# Altium project dsau-motherboard-revA.PrjPcb (part 1 of 2)
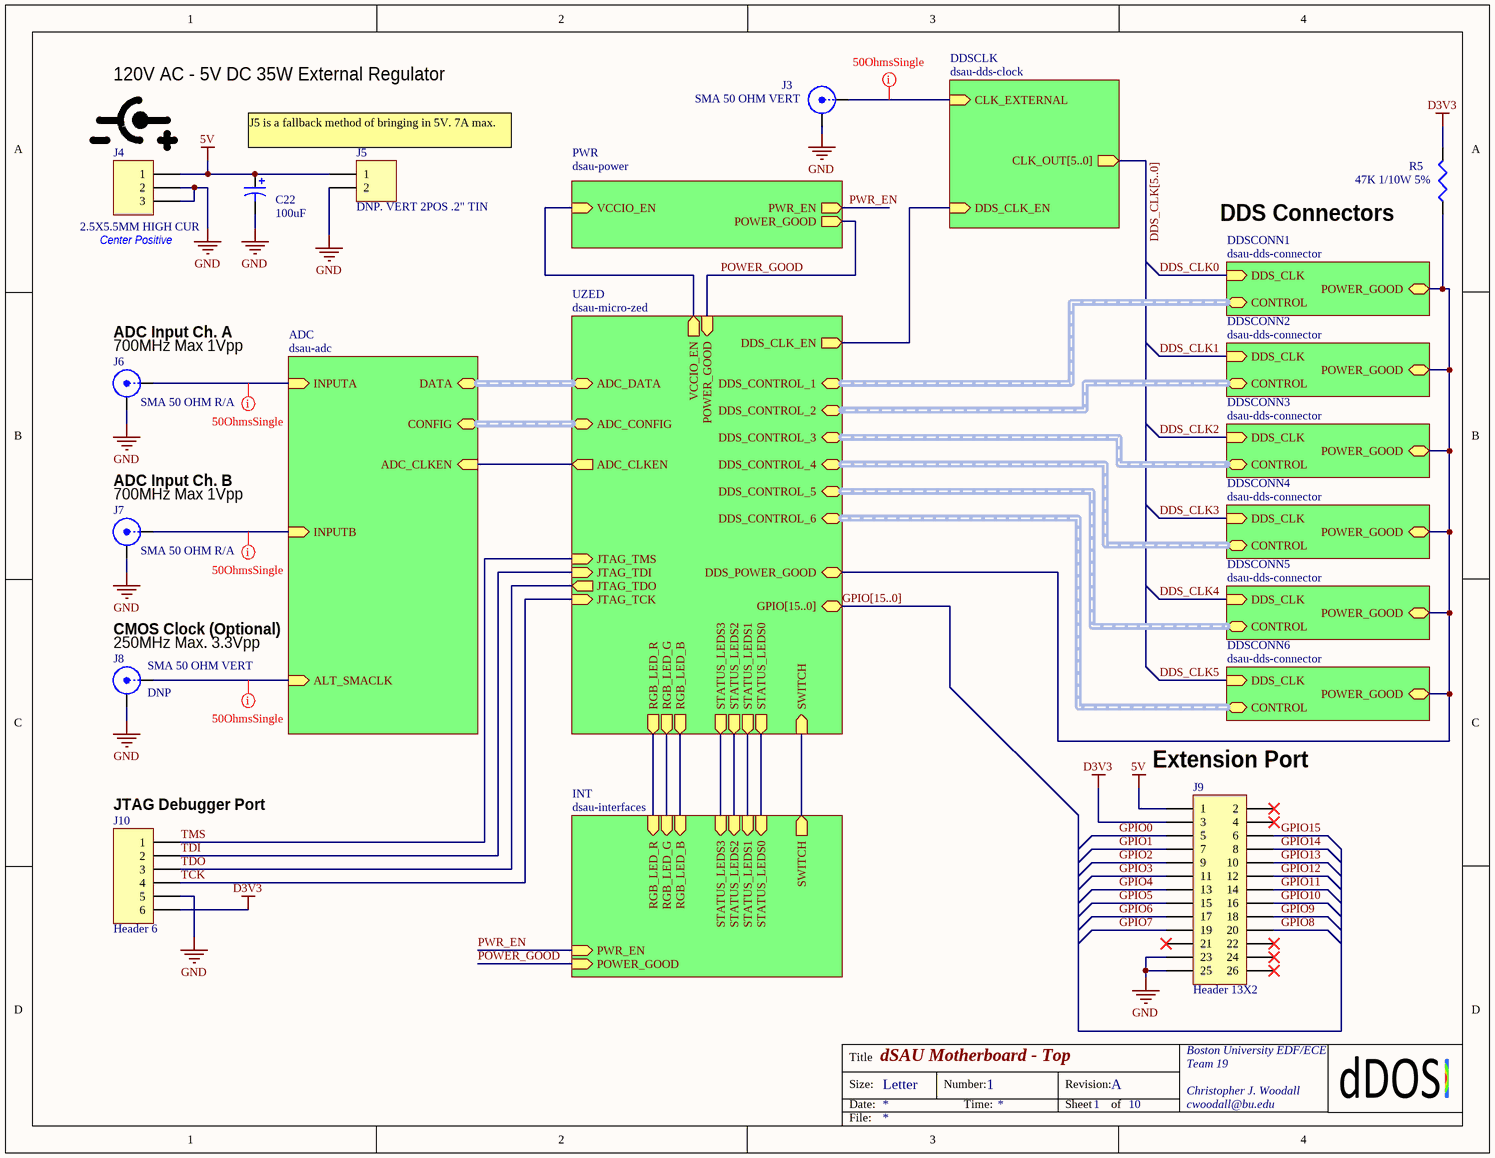
[diagram p0: dsau-motherboard-top.SchDoc]
email: <cwoodall@bu.edu>; Engineer: Christopher J. Woodall; Revision: A
10 sheets, 212 parts. Net scope: hierarchical (ports join the sheet entries above them; power ports are global).
Board file: dsau-motherboard-revA.PcbDoc
Sheets:
  dsau-motherboard-top.SchDoc
    ADC = dsau-adc.SchDoc
      AFE1 = dsau-adc-frontend.SchDoc
      AFE2 = dsau-adc-frontend.SchDoc
    PWR = dsau-power.SchDoc
    UZED = dsau-micro-zed.SchDoc
      UZEDB34 = dsau-micro-zed-bank34.SchDoc
      UZEDB35 = dsau-micro-zed-bank35.SchDoc
    DDSCONN1 = dsau-dds-connector.SchDoc
    INT = dsau-interfaces.SchDoc
    DDSCLK = dsau-dds-clock.SchDoc
    DDSCONN2 = dsau-dds-connector.SchDoc
    DDSCONN3 = dsau-dds-connector.SchDoc
    DDSCONN4 = dsau-dds-connector.SchDoc
    DDSCONN5 = dsau-dds-connector.SchDoc
    DDSCONN6 = dsau-dds-connector.SchDoc

## Sheet dsau-motherboard-top.SchDoc: dSAU Motherboard - Top
size Letter; Engineer: Christopher J. Woodall; Organization: Boston University EDF/ECE; DocumentNumber: 1; Revision: A; SheetNumber: 1; SheetTotal: 10; EMAIL: cwoodall@bu.edu; TeamName: Team 19; ProjectName: dSAU

### Parts
C22  value 100uF  [CAPPOL3216]  (hidden comment: TANT 100UF 10V 20%)
J3  SMA 50 OHM VERT  [MOLEX_SMBVERT_731000207]
J4  2.5X5.5MM HIGH CUR  [PJ-002BH]
J5  DNP. VERT 2POS .2" TIN  [MOLEX_2POS_200mil_0010085021]
J6  SMA 50 OHM R/A  [MOLEX_SMBRA_731000103]
J7  SMA 50 OHM R/A  [MOLEX_SMBRA_731000103]
J8  SMA 50 OHM VERT  value DNP  [MOLEX_SMBVERT_731000207]
J9  Header 13X2  [HDR2X13]
J10  Header 6  [HDR1X6]
R5  47K 1/10W 5%  [RESC1608L]

### Sub-sheets
ADC = dsau-adc: INPUTA (in), INPUTB (in), ALT_SMACLK (in), DATA (harness ADS62P49_LVDSDDR), ADC_CLKEN (in), CONFIG (harness ADS62P49_SPI_CONFIG)
DDSCLK = dsau-dds-clock: CLK_OUT[5..0] (out), DDS_CLK_EN (in), CLK_EXTERNAL (in)
DDSCONN1 = dsau-dds-connector: CONTROL (harness DDS_CONNECTOR), DDS_CLK (in), POWER_GOOD
DDSCONN2 = dsau-dds-connector: CONTROL (harness DDS_CONNECTOR), DDS_CLK (in), POWER_GOOD
DDSCONN3 = dsau-dds-connector: CONTROL (harness DDS_CONNECTOR), DDS_CLK (in), POWER_GOOD
DDSCONN4 = dsau-dds-connector: CONTROL (harness DDS_CONNECTOR), DDS_CLK (in), POWER_GOOD
DDSCONN5 = dsau-dds-connector: CONTROL (harness DDS_CONNECTOR), DDS_CLK (in), POWER_GOOD
DDSCONN6 = dsau-dds-connector: CONTROL (harness DDS_CONNECTOR), DDS_CLK (in), POWER_GOOD
INT = dsau-interfaces: STATUS_LEDS0 (in), STATUS_LEDS1 (in), STATUS_LEDS2 (in), STATUS_LEDS3 (in), RGB_LED_R (in), RGB_LED_G (in), RGB_LED_B (in), SWITCH (out), POWER_GOOD (in), PWR_EN (in)
PWR = dsau-power: VCCIO_EN (in), POWER_GOOD (out), PWR_EN (out)
UZED = dsau-micro-zed: ADC_DATA (harness ADS62P49_LVDSDDR), ADC_CONFIG (harness ADS62P49_SPI_CONFIG), ADC_CLKEN (out), DDS_CONTROL_1 (harness DDS_CONNECTOR), DDS_CONTROL_2 (harness DDS_CONNECTOR), DDS_CONTROL_3 (harness DDS_CONNECTOR), DDS_CONTROL_4 (harness DDS_CONNECTOR), DDS_CONTROL_5 (harness DDS_CONNECTOR), DDS_CONTROL_6 (harness DDS_CONNECTOR), JTAG_TCK (in), JTAG_TDI (in), JTAG_TDO (out), JTAG_TMS (in), STATUS_LEDS0 (out), STATUS_LEDS1 (out), STATUS_LEDS2 (out), STATUS_LEDS3 (out), RGB_LED_R (out), RGB_LED_G (out), RGB_LED_B (out), SWITCH (in), GPIO[15..0] (bidir), VCCIO_EN (out), POWER_GOOD (in), DDS_CLK_EN (out), DDS_POWER_GOOD

### Nets
5V: C22.1 J4.1 J5.1 J9.1
D3V3: J9.3 J10.6 R5.2
GND: C22.2 J3.2(Y) J4.2 J4.3 J5.2 J6.2(Y) J7.2(Y) J8.2(Y) J9.23 J9.25 J10.5
GPIO0: J9.5
GPIO1: J9.7
GPIO2: J9.9
GPIO3: J9.11
GPIO4: J9.13
GPIO5: J9.15
GPIO6: J9.17
GPIO7: J9.19
GPIO8: J9.20
GPIO9: J9.18
GPIO10: J9.16
GPIO11: J9.14
GPIO12: J9.12
GPIO13: J9.10
GPIO14: J9.8
GPIO15: J9.6
POWER_GOOD: sheet PWR/POWER_GOOD, sheet UZED/POWER_GOOD, sheet INT/POWER_GOOD
PWR_EN: sheet PWR/PWR_EN, sheet INT/PWR_EN
TCK: J10.4 ; sheet UZED/JTAG_TCK
TDI: J10.2 ; sheet UZED/JTAG_TDI
TDO: J10.3 ; sheet UZED/JTAG_TDO
TMS: J10.1 ; sheet UZED/JTAG_TMS
NetC1_1_1: J6.1(X) ; sheet ADC/INPUTA
NetC1_2_1: J7.1(X) ; sheet ADC/INPUTB
NetJ1_1_8: R5.1 ; sheet UZED/DDS_POWER_GOOD, sheet DDSCONN1/POWER_GOOD, sheet DDSCONN2/POWER_GOOD, sheet DDSCONN3/POWER_GOOD, sheet DDSCONN4/POWER_GOOD, sheet DDSCONN5/POWER_GOOD, sheet DDSCONN6/POWER_GOOD
NetJ3_1: J3.1(X) ; sheet DDSCLK/CLK_EXTERNAL
NetJ8_1: J8.1(X) ; sheet ADC/ALT_SMACLK
NetJP1_3: sheet ADC/ADC_CLKEN, sheet UZED/ADC_CLKEN
NetJP5_3: sheet UZED/DDS_CLK_EN, sheet DDSCLK/DDS_CLK_EN
NetQ3_1: sheet UZED/RGB_LED_R, sheet INT/RGB_LED_R
NetQ4_1: sheet UZED/RGB_LED_G, sheet INT/RGB_LED_G
NetQ5_1: sheet UZED/RGB_LED_B, sheet INT/RGB_LED_B
NetQ6_1: sheet UZED/STATUS_LEDS0, sheet INT/STATUS_LEDS0
NetQ7_1: sheet UZED/STATUS_LEDS1, sheet INT/STATUS_LEDS1
NetQ8_1: sheet UZED/STATUS_LEDS2, sheet INT/STATUS_LEDS2
NetQ9_1: sheet UZED/STATUS_LEDS3, sheet INT/STATUS_LEDS3
NetR18_2: sheet UZED/SWITCH, sheet INT/SWITCH
NetU8_3: sheet PWR/VCCIO_EN, sheet UZED/VCCIO_EN

Not connected (* = marked no-connect by the designer): J9 2* 4* 21* 22* 24* 26*

### Buses and harness runs
bus DDS_CLK[5..0] = sheet DDSCLK/CLK_OUT[5..0]
bus GPIO[15..0] = sheet UZED/GPIO[15..0]
harness sheet ADC/CONFIG = sheet UZED/ADC_CONFIG
harness sheet ADC/DATA = sheet UZED/ADC_DATA
harness sheet DDSCONN1/CONTROL = sheet UZED/DDS_CONTROL_1
harness sheet DDSCONN2/CONTROL = sheet UZED/DDS_CONTROL_2
harness sheet DDSCONN3/CONTROL = sheet UZED/DDS_CONTROL_3
harness sheet DDSCONN4/CONTROL = sheet UZED/DDS_CONTROL_4
harness sheet DDSCONN5/CONTROL = sheet UZED/DDS_CONTROL_5
harness sheet DDSCONN6/CONTROL = sheet UZED/DDS_CONTROL_6

### Layout directives
net class 50OhmsSingle: NetC1_1_1, NetC1_2_1, NetJ3_1, NetJ8_1

### Notes on the sheet
- 120V AC - 5V DC 35W External Regulator
- J5 is a fallback method of bringing in 5V. 7A max.
- (near R5) DDS Connectors
- (near J4) Center Positive
- (near J6) ADC Input Ch. A
- (near J6) 700MHz Max 1Vpp
- (near J7) ADC Input Ch. B
- (near J7) 700MHz Max 1Vpp
- (near J8) CMOS Clock (Optional)
- (near J8) 250MHz Max. 3.3Vpp
- (near J9) Extension Port
- (near J10) JTAG Debugger Port
- Title
- Size:
- Date:
- Letter
- Number:
- Time:
- Revision:
- Sheet
- of
- File:

### Library data of the parts
C22 = Cap Pol3: Polarized Capacitor (Surface Mount); Manufacturer: Vishay Sprague; Manufacturer Part Number: TL8A0107M010C; Published: 8-Jun-2000; LatestRevisionDate: 29-May-2009; LatestRevisionNote: IPC-7351 Footprint Added.; PackageReference: C1206; Publisher: Altium Limited; PackageDescription: Chip Capacitor; Supplier 1: Digi-Key; Supplier Part Number 1: 718-1921-1-ND
J3 J8 = SMB: SMB Straight Connector; Manufacturer: Molex Inc; Manufacturer Part Number: 0733910060; LatestRevisionDate: 17-Jul-2002; LatestRevisionNote: Re-released for DXP Platform.; Publisher: Altium Limited; Supplier 1: Digi-Key; Supplier Part Number 1: WM5543-ND
J4 = Header 3: Header, 3-Pin; Manufacturer: CUI Inc; LatestRevisionDate: 17-Jul-2002; LatestRevisionNote: Re-released for DXP Platform.; Publisher: Altium Limited; Manufacturer Part Number: PJ-002BH; Supplier 1: Digi-Key; Supplier Part Number 1: CP-002BH-ND
J5 = Header 2: Header, 2-Pin; Manufacturer: Molex Inc; Manufacturer Part Number: 0010085021; LatestRevisionDate: 17-Jul-2002; LatestRevisionNote: Re-released for DXP Platform.; Publisher: Altium Limited; Supplier 1: Digi-Key; Supplier Part Number 1: WM4333-ND
J6 J7 = SMB: SMB Straight Connector; Manufacturer: Molex Inc; Manufacturer Part Number: 0733910320; LatestRevisionDate: 17-Jul-2002; LatestRevisionNote: Re-released for DXP Platform.; Publisher: Altium Limited; Supplier 1: Digi-Key; Supplier Part Number 1: WM8554-ND
J9 = Header 13X2: Header, 13-Pin, Dual row; LatestRevisionDate: 17-Jul-2002; LatestRevisionNote: Re-released for DXP Platform.; Publisher: Altium Limited; Supplier 1: Stock; Supplier Part Number 1: 2x13 pin 100mil Headers
J10 = Header 6: Header, 6-Pin; LatestRevisionDate: 17-Jul-2002; LatestRevisionNote: Re-released for DXP Platform.; Publisher: Altium Limited; Supplier 1: Stock; Supplier Part Number 1: 6 pin 100 mil
R5 = Res3: Resistor; Manufacturer: Yageo; Manufacturer Part Number: 311-47kGRCT-ND; Published: 8-Jun-2000; LatestRevisionDate: 29-May-2009; LatestRevisionNote: IPC-7351 Footprint Added.; PackageReference: J1-0603; Publisher: Altium Limited; PackageDescription: Chip Resistor; Supplier 1: Digi-Key; Supplier Part Number 1: 311-47KGRTR-ND; Value: 47K

## Sheet dsau-adc.SchDoc: dSAU Motherboard - ADC
size Letter; Engineer: Christopher J. Woodall; Organization: Boston University EDF/ECE; DocumentNumber: 3; Revision: A; SheetNumber: 3; SheetTotal: 10; EMAIL: cwoodall@bu.edu; TeamName: Team 19; ProjectName: dSAU
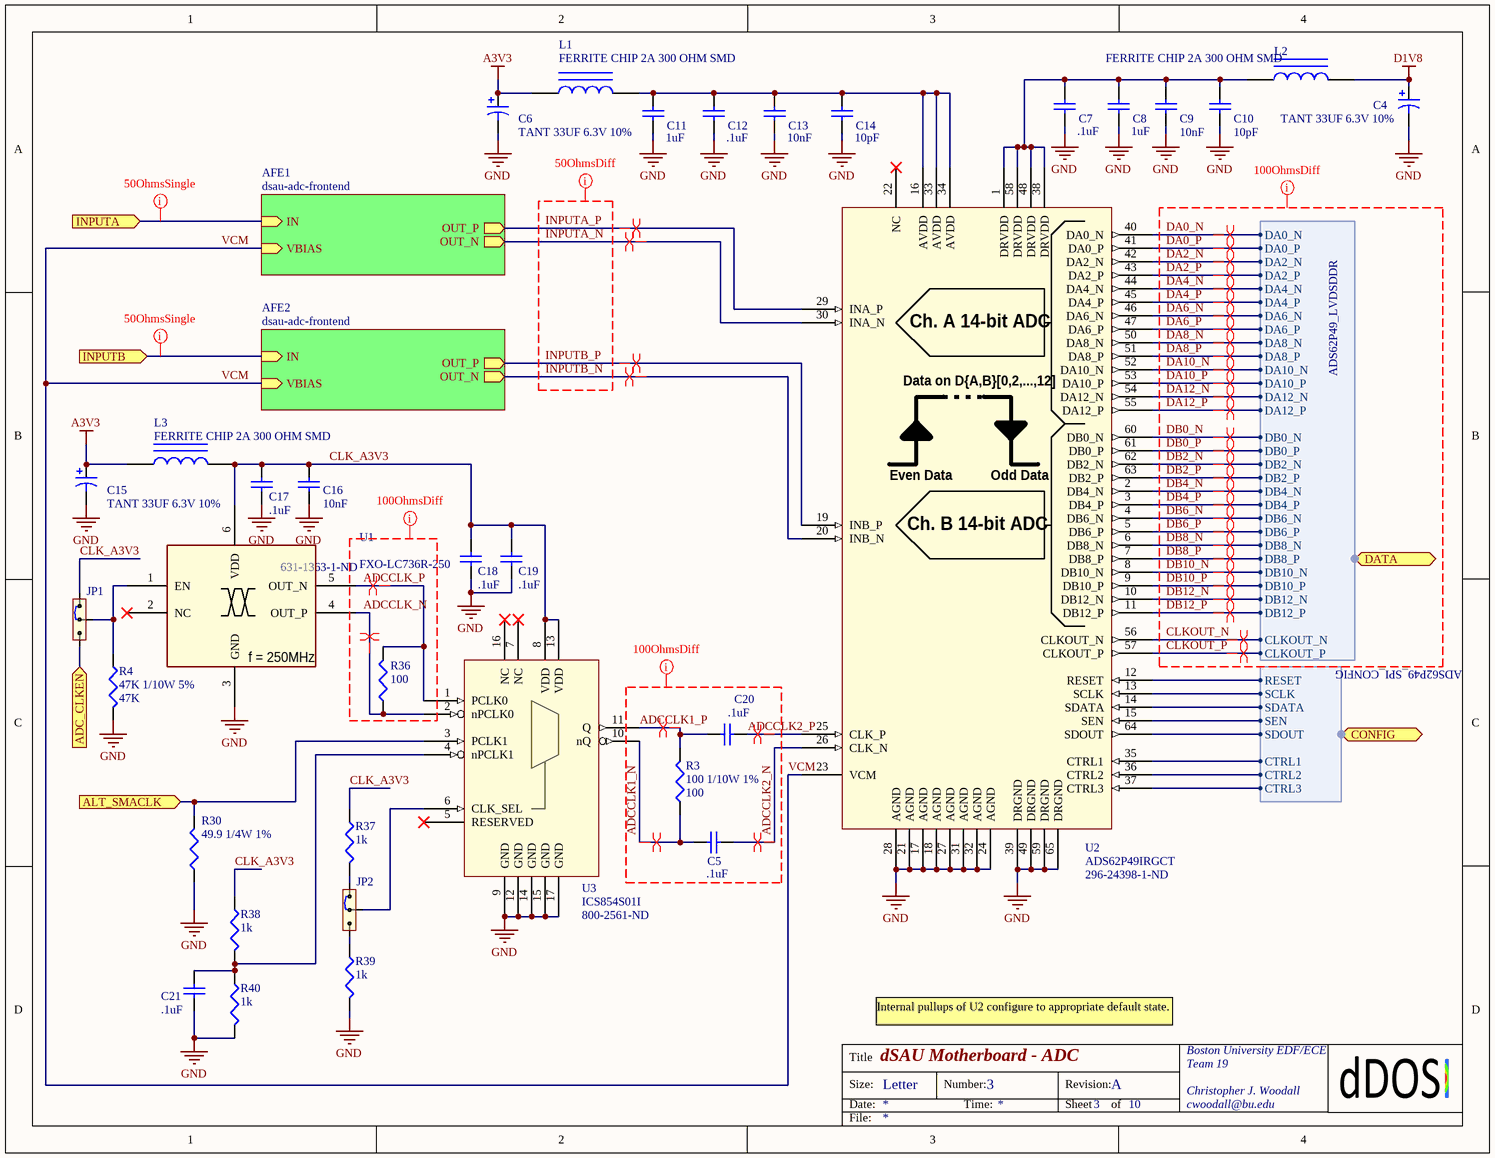
[diagram p1: dsau-adc.SchDoc]

### Parts
C4  TANT 33UF 6.3V 10%  [CAPC2012L]
C5  value .1uF  [CAPC1608L]  (hidden comment: CER 0.1UF 50V Y5V)
C6  TANT 33UF 6.3V 10%  [CAPC2012L]
C7  value .1uF  [CAPC1608L]  (hidden comment: CER 0.1UF 50V Y5V)
C8  value 1uF  [CAPC2012L]  (hidden comment: CER 1UF 16V 10% X7R)
C9  value 10nF  [CAPC1608L]  (hidden comment: CER 10NF 25V 10% NP0)
C10  value 10pF  [CAPC1608L]  (hidden comment: CER 10PF 50V 5% NP0)
C11  value 1uF  [CAPC2012L]  (hidden comment: CER 1UF 16V 10% X7R)
C12  value .1uF  [CAPC1608L]  (hidden comment: CER 0.1UF 50V Y5V)
C13  value 10nF  [CAPC1608L]  (hidden comment: CER 10NF 25V 10% NP0)
C14  value 10pF  [CAPC1608L]  (hidden comment: CER 10PF 50V 5% NP0)
C15  TANT 33UF 6.3V 10%  [CAPC2012L]
C16  value 10nF  [CAPC1608L]  (hidden comment: CER 10NF 25V 10% NP0)
C17  value .1uF  [CAPC1608L]  (hidden comment: CER 0.1UF 50V Y5V)
C18  value .1uF  [CAPC1608L]  (hidden comment: CER 0.1UF 50V Y5V)
C19  value .1uF  [CAPC1608L]  (hidden comment: CER 0.1UF 50V Y5V)
C20  value .1uF  [CAPC1608L]  (hidden comment: CER 0.1UF 50V Y5V)
C21  value .1uF  [CAPC1608L]  (hidden comment: CER 0.1UF 50V Y5V)
JP1  JUMPER_2WAY  [HDR1X3]  (value not drawn)
JP2  JUMPER_2WAY  [HDR1X3]  (value not drawn)
L1  FERRITE CHIP 2A 300 OHM SMD  [INDC1608L]
L2  FERRITE CHIP 2A 300 OHM SMD  [INDC1608L]
L3  FERRITE CHIP 2A 300 OHM SMD  [INDC1608L]
R3  100 1/10W 1%  value 100  [RESC1608L]
R4  47K 1/10W 5%  value 47K  [RESC1608L]
R30  49.9 1/4W 1%  [RESC3216L]
R36  value 100  [RESC1608L]  (hidden comment: 100 1/10W 1%)
R37  value 1k  [RESC1608L]  (hidden comment: 100 1/10W 1%)
R38  value 1k  [RESC1608L]  (hidden comment: 100 1/10W 1%)
R39  value 1k  [RESC1608L]  (hidden comment: 100 1/10W 1%)
R40  value 1k  [RESC1608L]  (hidden comment: 100 1/10W 1%)
U1  Supplier Part Number 1: 631-1363-1-ND  Manufacturer Part Number: FXO-LC736R-250  [FXO-LC736R-SMD_6]  (hidden comment: FXO-LC736R-250MHz)
U2  Manufacturer Part Number: ADS62P49IRGCT  Supplier Part Number 1: 296-24398-1-ND  [VQFN-64]  (hidden comment: ADS62P49_SINGLE)
U3  ICS854S01I  Supplier Part Number 1: 800-2561-ND  [VFQFN16_CUSTOM]

### Sub-sheets
AFE1 = dsau-adc-frontend: IN (in), OUT_P (out), OUT_N (out), VBIAS (in)
AFE2 = dsau-adc-frontend: IN (in), OUT_P (out), OUT_N (out), VBIAS (in)

### Ports
ADC_CLKEN (in), ALT_SMACLK (in), CONFIG (harness ADS62P49_SPI_CONFIG), DATA (harness ADS62P49_LVDSDDR), INPUTA (in), INPUTB (in)

### Harnesses
ADS62P49_LVDSDDR: DA0_N, DA2_N, DA4_N, DA6_N, DA8_N, DA10_N, DA12_N, DA0_P, DA2_P, DA4_P, DA6_P, DA8_P, DA10_P, DA12_P, DB0_N, DB2_N, DB4_N, DB6_N, DB8_N, DB10_N, DB12_N, DB0_P, DB2_P, DB4_P, DB6_P, DB8_P, DB10_P, DB12_P, CLKOUT_P, CLKOUT_N
ADS62P49_SPI_CONFIG: RESET, SCLK, SDATA, SEN, SDOUT, CTRL1, CTRL2, CTRL3

### Nets
A3V3: C6.1 C15.1 L1.2 L3.2
D1V8: C4.1 L2.1
GND: C4.2 C6.2 C7.2 C8.2 C9.2 C10.2 C11.2 C12.2 C13.2 C14.2 C15.2 C16.2 C17.2 C18.2 C19.2 C21.2 R4.2 R30.1 R39.2 R40.2 U1.3(GND) U2.17(AGND) U2.18(AGND) U2.21(AGND) U2.24(AGND) U2.27(AGND) U2.28(AGND) U2.31(AGND) U2.32(AGND) U2.39(DRGND) U2.49(DRGND) U2.59(DRGND) U2.65(DRGND) U3.9(GND) U3.12(GND) U3.14(GND) U3.15(GND) U3.17(GND)
ADCCLK1_N: C5.1 R3.1 U3.10(nQ)
ADCCLK1_P: C20.1 R3.2 U3.11(Q)
ADCCLK2_N: C5.2 U2.26(CLK_N)
ADCCLK2_P: C20.2 U2.25(CLK_P)
ADCCLK_N: R36.1 U1.4(OUT_P) U3.2(nPCLK0)
ADCCLK_P: R36.2 U1.5(OUT_N) U3.1(PCLK0)
CLK_A3V3: C16.1 C17.1 C18.1 C19.1 JP1.1 L3.1 R37.1 R38.1 U1.6(VDD) U3.8(VDD) U3.13(VDD)
CLKOUT_N: U2.56(CLKOUT_N) ; port DATA.CLKOUT_N
CLKOUT_P: U2.57(CLKOUT_P) ; port DATA.CLKOUT_P
DA0_N: U2.40(DA0_N) ; port DATA.DA0_N
DA0_P: U2.41(DA0_P) ; port DATA.DA0_P
DA2_N: U2.42(DA2_N) ; port DATA.DA2_N
DA2_P: U2.43(DA2_P) ; port DATA.DA2_P
DA4_N: U2.44(DA4_N) ; port DATA.DA4_N
DA4_P: U2.45(DA4_P) ; port DATA.DA4_P
DA6_N: U2.46(DA6_N) ; port DATA.DA6_N
DA6_P: U2.47(DA6_P) ; port DATA.DA6_P
DA8_N: U2.50(DA8_N) ; port DATA.DA8_N
DA8_P: U2.51(DA8_P) ; port DATA.DA8_P
DA10_N: U2.52(DA10_N) ; port DATA.DA10_N
DA10_P: U2.53(DA10_P) ; port DATA.DA10_P
DA12_N: U2.54(DA12_N) ; port DATA.DA12_N
DA12_P: U2.55(DA12_P) ; port DATA.DA12_P
DB0_N: U2.60(DB0_N) ; port DATA.DB0_N
DB0_P: U2.61(DB0_P) ; port DATA.DB0_P
DB2_N: U2.62(DB2_N) ; port DATA.DB2_N
DB2_P: U2.63(DB2_P) ; port DATA.DB2_P
DB4_N: U2.2(DB4_N) ; port DATA.DB4_N
DB4_P: U2.3(DB4_P) ; port DATA.DB4_P
DB6_N: U2.4(DB6_N) ; port DATA.DB6_N
DB6_P: U2.5(DB6_P) ; port DATA.DB6_P
DB8_N: U2.6(DB8_N) ; port DATA.DB8_N
DB8_P: U2.7(DB8_P) ; port DATA.DB8_P
DB10_N: U2.8(DB10_N) ; port DATA.DB10_N
DB10_P: U2.9(DB10_P) ; port DATA.DB10_P
DB12_N: U2.10(DB12_N) ; port DATA.DB12_N
DB12_P: U2.11(DB12_P) ; port DATA.DB12_P
INPUTA_N: U2.30(INA_N) ; sheet AFE1/OUT_N
INPUTA_P: U2.29(INA_P) ; sheet AFE1/OUT_P
INPUTB_N: U2.20(INB_N) ; sheet AFE2/OUT_N
INPUTB_P: U2.19(INB_P) ; sheet AFE2/OUT_P
VCM: U2.23(VCM) ; sheet AFE1/VBIAS, sheet AFE2/VBIAS
NetC1_1_1: port INPUTA, sheet AFE1/IN
NetC1_2_1: port INPUTB, sheet AFE2/IN
NetC7_1: C7.1 C8.1 C9.1 C10.1 L2.2 U2.1(DRVDD) U2.38(DRVDD) U2.48(DRVDD) U2.58(DRVDD)
NetC11_1: C11.1 C12.1 C13.1 C14.1 L1.1 U2.16(AVDD) U2.33(AVDD) U2.34(AVDD)
NetC21_1: C21.1 R38.2 R40.1 U3.4(nPCLK1)
NetJ8_1: R30.2 U3.3(PCLK1) ; port ALT_SMACLK
NetJP1_2: JP1.2 R4.1 U1.1(EN)
NetJP1_3: JP1.3 ; port ADC_CLKEN
NetJP2_1: JP2.1 R37.2
NetJP2_2: JP2.2 U3.6(CLK_SEL)
NetJP2_3: JP2.3 R39.1
NetU2_12: U2.12(RESET) ; port CONFIG.RESET
NetU2_13: U2.13(SCLK) ; port CONFIG.SCLK
NetU2_14: U2.14(SDATA) ; port CONFIG.SDATA
NetU2_15: U2.15(SEN) ; port CONFIG.SEN
NetU2_35: U2.35(CTRL1) ; port CONFIG.CTRL1
NetU2_36: U2.36(CTRL2) ; port CONFIG.CTRL2
NetU2_37: U2.37(CTRL3) ; port CONFIG.CTRL3
NetU2_64: U2.64(SDOUT) ; port CONFIG.SDOUT

Not connected (* = marked no-connect by the designer): U1 2(NC)*; U2 22(NC)*; U3 5(RESERVED)* 7(NC)* 16(NC)*

### Layout directives
differential pair: ADCCLK1_N, ADCCLK1_P, ADCCLK2_N, ADCCLK2_P, ADCCLK_N, ADCCLK_P, CLKOUT_N, CLKOUT_P, DA0_N, DA0_P, DA2_N, DA2_P, DA4_N, DA4_P, DA6_N, DA6_P, DA8_N, DA8_P, DA10_N, DA10_P, DA12_N, DA12_P, DB0_N, DB0_P, DB2_N, DB2_P, DB4_N, DB4_P, DB6_N, DB6_P, DB8_N, DB8_P, DB10_N, DB10_P, DB12_N, DB12_P, INPUTA_N, INPUTA_P, INPUTB_N, INPUTB_P
net class 100OhmsDiff: ADCCLK1_N, ADCCLK1_P, ADCCLK2_N, ADCCLK2_P, ADCCLK_N, ADCCLK_P, CLKOUT_N, CLKOUT_P, DA0_N, DA0_P, DA2_N, DA2_P, DA4_N, DA4_P, DA6_N, DA6_P, DA8_N, DA8_P, DA10_N, DA10_P, DA12_N, DA12_P, DB0_N, DB0_P, DB2_N, DB2_P, DB4_N, DB4_P, DB6_N, DB6_P, DB8_N, DB8_P, DB10_N, DB10_P, DB12_N, DB12_P
net class 50OhmsDiff: INPUTA_N, INPUTA_P, INPUTB_N, INPUTB_P
net class 50OhmsSingle: NetC1_1_1, NetC1_2_1

### Notes on the sheet
- Internal pullups of U2 configure to appropriate default state.
  In case where RESET is pulled low all possible valid states (for our application) are available by pulling SCLK, SDATA, SEN low.
- Title
- Size:
- Date:
- Letter
- Number:
- Time:
- Revision:
- Sheet
- of
- File:
- (in symbol ADS62P49_SINGLE) Ch. A 14-bit ADC; Data on D{A,B}[0,2,...,12]; Even Data; Odd Data; Ch. B 14-bit ADC
- (in symbol FXO-LC736R-250MHz) f = 250MHz

### Library data of the parts
C4 C6 C15 = Cap Pol3: Polarized Capacitor (Surface Mount); Manufacturer: AVX Corporation; Manufacturer Part Number: TPSA336K006R0600; Published: 8-Jun-2000; LatestRevisionDate: 29-May-2009; LatestRevisionNote: IPC-7351 Footprint Added.; PackageReference: C1206; Publisher: Altium Limited; PackageDescription: Chip Capacitor; Value: 33uF; Supplier 1: Digi-Key; Supplier Part Number 1: 478-1755-1-ND
C5 C7 C12 C17-C21 = Cap: Capacitor; Manufacturer: Yageo; Manufacturer Part Number: CC0603ZRY5V9BB104; Published: 8-Jun-2000; LatestRevisionDate: 17-Jul-2002; LatestRevisionNote: Re-released for DXP Platform.; PackageReference: RAD-0.3; Publisher: Altium Limited; Supplier 1: Digi-Key; Supplier Part Number 1: 311-1343-1-ND
C8 C11 = Cap: Capacitor; Manufacturer: Yageo; Manufacturer Part Number: CC0805KKX7R7BB105; Published: 8-Jun-2000; LatestRevisionDate: 17-Jul-2002; LatestRevisionNote: Re-released for DXP Platform.; PackageReference: RAD-0.3; Publisher: Altium Limited; Supplier 1: Digi-Key; Supplier Part Number 1: 311-1365-1-ND
C9 C13 C16 = Cap: Capacitor; Manufacturer: Kemet; Manufacturer Part Number: C0603C103K3GACTU; Published: 8-Jun-2000; LatestRevisionDate: 17-Jul-2002; LatestRevisionNote: Re-released for DXP Platform.; PackageReference: RAD-0.3; Publisher: Altium Limited; Supplier 1: Digi-Key; Supplier Part Number 1: 399-8987-1-ND
C10 C14 = Cap: Capacitor; Manufacturer: Samsung Electro-Mechanics America, Inc; Manufacturer Part Number: CL10C100JB8NCNC; Published: 8-Jun-2000; LatestRevisionDate: 17-Jul-2002; LatestRevisionNote: Re-released for DXP Platform.; PackageReference: RAD-0.3; Publisher: Altium Limited; Supplier 1: Digi-Key; Supplier Part Number 1: 1276-2154-1-ND
L1-L3 = Inductor Iron: Magnetic-Core Inductor; Manufacturer: Laird-Signal Integrity Products; Manufacturer Part Number: MI0603L301R-10; Value: 2A 300 OHM @ 100MHz; Published: 24-Mar-1999; LatestRevisionDate: 17-Jul-2002; LatestRevisionNote: Re-released for DXP Platform.; PackageReference: AXIAL-0.9; Publisher: Altium Limited; Supplier 1: Digi-Key; Supplier Part Number 1: 240-2374-1-ND
R3 R36 = Res3: Resistor; Manufacturer: Yageo; Manufacturer Part Number: RC0603FR-07100RL; Published: 8-Jun-2000; LatestRevisionDate: 29-May-2009; LatestRevisionNote: IPC-7351 Footprint Added.; PackageReference: J1-0603; Publisher: Altium Limited; PackageDescription: Chip Resistor; Supplier 1: Digi-Key; Supplier Part Number 1: 311-100HRCT-ND
R4 = Res3: as R5 on sheet dsau-motherboard-top; Published: 8-Jun-2000; LatestRevisionDate: 29-May-2009; LatestRevisionNote: IPC-7351 Footprint Added.; PackageReference: J1-0603; Publisher: Altium Limited; PackageDescription: Chip Resistor; Supplier 1: Digi-Key; Supplier Part Number 1: 311-47KGRTR-ND
R30 = Res3: Resistor; Manufacturer: Panasonic Electronic Components; Manufacturer Part Number: ERJ-8ENF49R9V; Value: 49.9; Published: 8-Jun-2000; LatestRevisionDate: 29-May-2009; LatestRevisionNote: IPC-7351 Footprint Added.; PackageReference: J1-0603; Publisher: Altium Limited; PackageDescription: Chip Resistor; Supplier 1: Digi-Key; Supplier Part Number 1: P49.9FCT-ND
R37-R40 = Res3: Resistor; Manufacturer: Yageo; Manufacturer Part Number: RC0603JR-071KL; Published: 8-Jun-2000; LatestRevisionDate: 29-May-2009; LatestRevisionNote: IPC-7351 Footprint Added.; PackageReference: J1-0603; Publisher: Altium Limited; PackageDescription: Chip Resistor; Supplier 1: Digi-Key; Supplier Part Number 1: 311-1.0KGRCT-ND
U1 = FXO-LC736R-250MHz: OSC 250 MHZ 3.3V LVDS SMD; Manufacturer: Fox Electronics; Supplier 1: Digi-Key
U2 = ADS62P49_SINGLE: IC ADC DUAL 14BIT 250MSPS 64VQFN; Manufacturer: Texas Instruments; Supplier 1: Digi-key
U3 = ICS854S01I: Supplier 1: Digi-Key

## Sheet dsau-adc-frontend.SchDoc: dSAU Motherboard - ADC Frontend
size Letter; Engineer: Christopher J. Woodall; Organization: Boston University EDF/ECE; DocumentNumber: 4; Revision: A; SheetNumber: 4; SheetTotal: 10; EMAIL: cwoodall@bu.edu; TeamName: Team 19; ProjectName: dSAU
Used 2 times, as channels ADC/AFE1, ADC/AFE2. Parts and nets are listed once, with the designators drawn on the sheet.
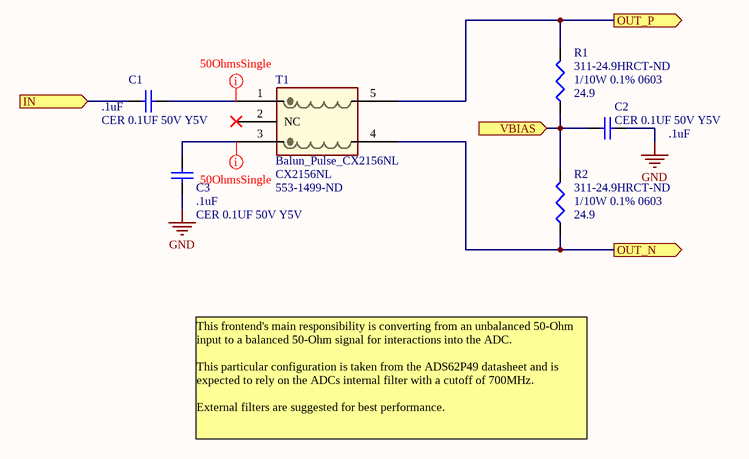
[diagram p2: dsau-adc-frontend.SchDoc]

### Parts
C1  CER 0.1UF 50V Y5V  value .1uF  [CAPC1608L]
C2  CER 0.1UF 50V Y5V  value .1uF  [CAPC1608L]
C3  CER 0.1UF 50V Y5V  value .1uF  [CAPC1608L]
R1  1/10W 0.1% 0603  value 24.9  Supplier Part Number 1: 311-24.9HRCT-ND  [RESC1608L]
R2  1/10W 0.1% 0603  value 24.9  Supplier Part Number 1: 311-24.9HRCT-ND  [RESC1608L]
T1  Balun_Pulse_CX2156NL  Manufacturer Part Number: CX2156NL  Supplier Part Number 1: 553-1499-ND  [CX2156NL_SMD5]

### Ports
IN (in), OUT_N (out), OUT_P (out), VBIAS (in)

### Nets
GND: C2.2 C3.1
IN: C1.1 ; port IN
OUT_N: R2.1 T1.4 ; port OUT_N
OUT_P: R1.2 T1.5 ; port OUT_P
VBIAS: C2.1 R1.1 R2.2 ; port VBIAS
NetC1_2: C1.2 T1.1
NetC3_2: C3.2 T1.3

Not connected (* = marked no-connect by the designer): T1 2(NC)*

### Channels
ADC/AFE1: designators end in _1; ports IN=NetC1_1_1 OUT_N=INPUTA_N OUT_P=INPUTA_P VBIAS=VCM
ADC/AFE2: designators end in _2; ports IN=NetC1_2_1 OUT_N=INPUTB_N OUT_P=INPUTB_P VBIAS=VCM

### Layout directives
net class 50OhmsSingle: NetC1_1_2, NetC3_1_2

### Notes on the sheet
- This frontend's main responsibility is converting from an unbalanced 50-Ohm input to a balanced 50-Ohm signal for interactions into the ADC.
  This particular configuration is taken from the ADS62P49 datasheet and is expected to rely on the ADCs internal filter with a cutoff of 700MHz.
  External filters are suggested for best performance.
- Title
- Size:
- Date:
- Letter
- Number:
- Time:
- Revision:
- Sheet
- of
- File:

### Library data of the parts
C1-C3 = Cap: as C5 on sheet dsau-adc; Published: 8-Jun-2000; LatestRevisionDate: 17-Jul-2002; LatestRevisionNote: Re-released for DXP Platform.; PackageReference: RAD-0.3; Publisher: Altium Limited; Supplier 1: Digi-Key; Supplier Part Number 1: 311-1343-1-ND
R1 R2 = Res3: Resistor; Manufacturer: Yageo; Manufacturer Part Number: RC0603FR-0724R9L; Published: 8-Jun-2000; LatestRevisionDate: 29-May-2009; LatestRevisionNote: IPC-7351 Footprint Added.; PackageReference: J1-0603; Publisher: Altium Limited; PackageDescription: Chip Resistor; Supplier 1: Digi-Key
T1 = Balun_Pulse_CX2156NL: TRANSFORMR BALUN 2.3-2700MHZ SMD; Manufacturer: Pulse Electronics Corporation; Supplier 1: Digi-Key

## Sheet dsau-power.SchDoc: dSAU Motherboard - Power
size Letter; Engineer: Christopher J. Woodall; Organization: Boston University EDF/ECE; DocumentNumber: 2; Revision: A; SheetNumber: 2; SheetTotal: 10; EMAIL: cwoodall@bu.edu; TeamName: Team 19; ProjectName: dSAU
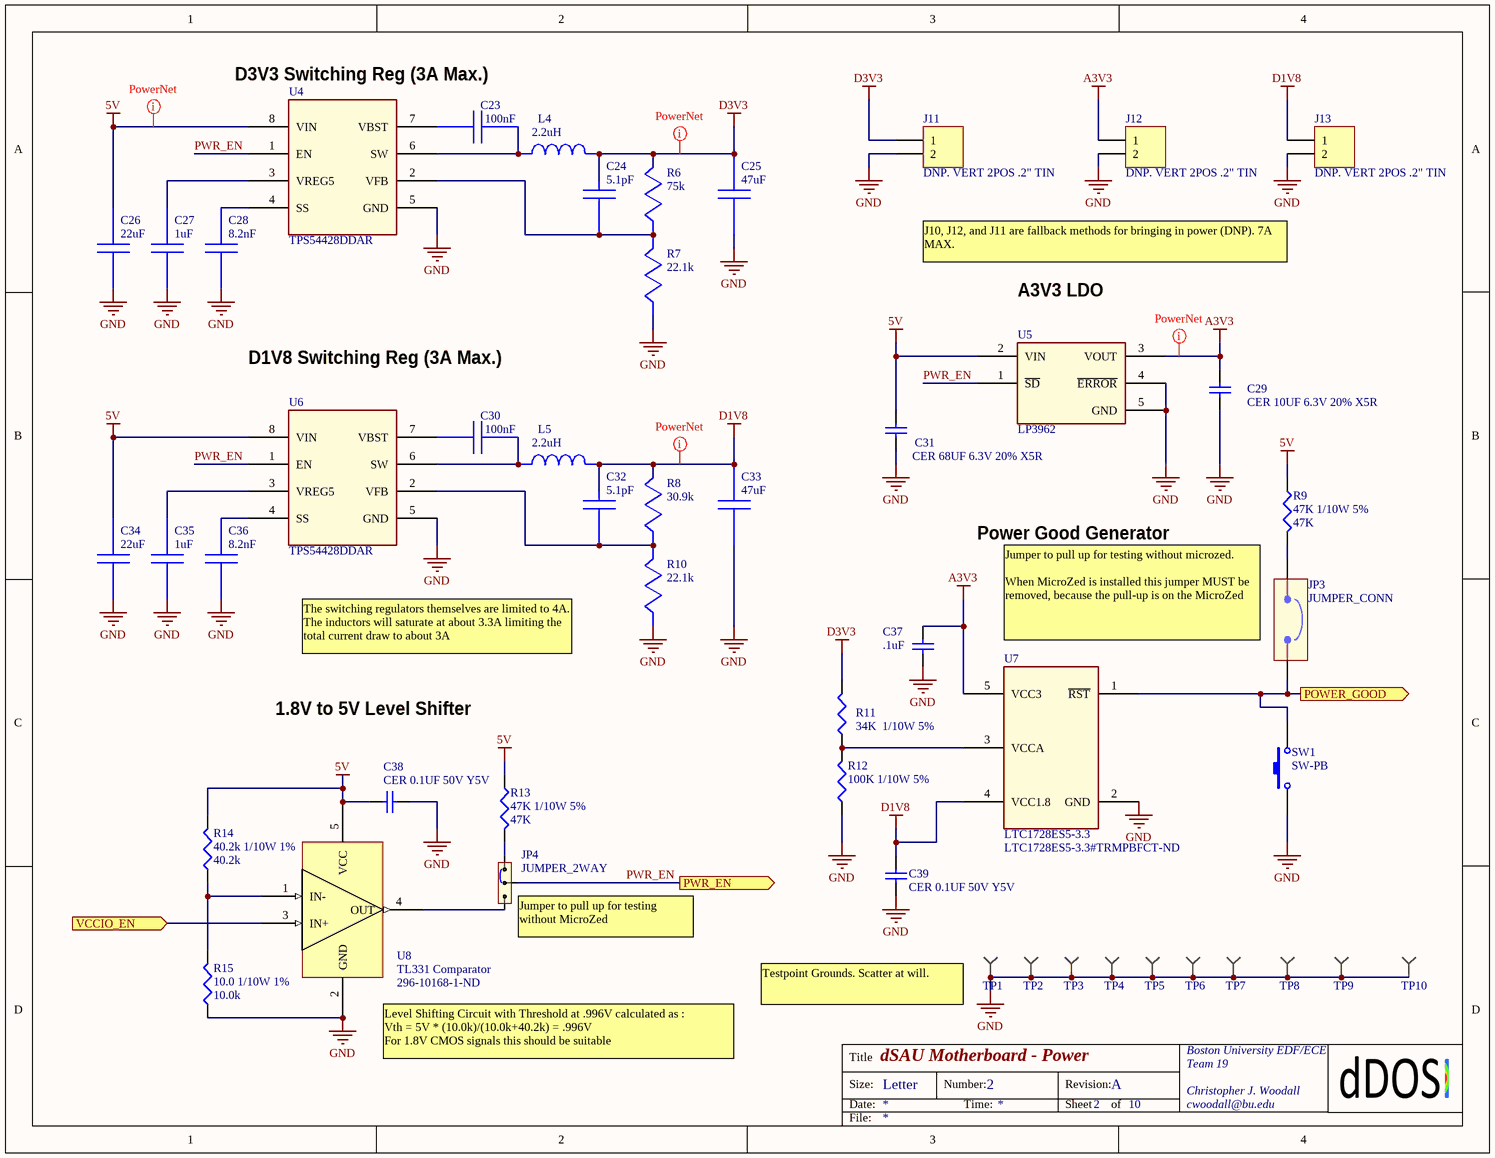
[diagram p3: dsau-power.SchDoc]

### Parts
C23  100nF  [0402]
C24  5.1pF  [0402]
C25  47uF  [1206]
C26  22uF  [1210]
C27  1uF  [0402]
C28  8.2nF  [0402]
C29  CER 10UF 6.3V 20% X5R  [CAPC1608L]
C30  100nF  [0402]
C31  CER 68UF 6.3V 20% X5R  [CAPC3216L]
C32  5.1pF  [0402]
C33  47uF  [1206]
C34  22uF  [1210]
C35  1uF  [0402]
C36  8.2nF  [0402]
C37  value .1uF  [CAPC1608L]  (hidden comment: CER 0.1UF 50V Y5V)
C38  CER 0.1UF 50V Y5V  [CAPC1608L]
C39  CER 0.1UF 50V Y5V  [CAPC1608L]
J11  DNP. VERT 2POS .2" TIN  [MOLEX_2POS_200mil_0010085021]
J12  DNP. VERT 2POS .2" TIN  [MOLEX_2POS_200mil_0010085021]
J13  DNP. VERT 2POS .2" TIN  [MOLEX_2POS_200mil_0010085021]
JP3  JUMPER_CONN  [HDR1X2]
JP4  JUMPER_2WAY  [HDR1X3]
L4  2.2uH  [SRN6045]
L5  2.2uH  [SRN6045]
R6  75k  [0402]
R7  22.1k  [0402]
R8  30.9k  [0402]
R9  47K 1/10W 5%  value 47K  [RESC1608L]
R10  22.1k  [0402]
R11  34K  1/10W 5%  [RESC1608L]
R12  100K 1/10W 5%  [RESC1608L]
R13  47K 1/10W 5%  value 47K  [RESC1608L]
R14  40.2k 1/10W 1%  value 40.2k  [RESC1608L]
R15  10.0 1/10W 1%  value 10.0k  [RESC1608L]
SW1  SW-PB  [SPST_SW_FSM4JH]
TP1  TESTPOINT_CW  [PIN1]  (value not drawn)
TP2  TESTPOINT_CW  [PIN1]  (value not drawn)
TP3  TESTPOINT_CW  [PIN1]  (value not drawn)
TP4  TESTPOINT_CW  [PIN1]  (value not drawn)
TP5  TESTPOINT_CW  [PIN1]  (value not drawn)
TP6  TESTPOINT_CW  [PIN1]  (value not drawn)
TP7  TESTPOINT_CW  [PIN1]  (value not drawn)
TP8  TESTPOINT_CW  [PIN1]  (value not drawn)
TP9  TESTPOINT_CW  [PIN1]  (value not drawn)
TP10  TESTPOINT_CW  [PIN1]  (value not drawn)
U4  TPS54428DDAR  [R-PDSO-G8]
U5  LP3962  [SOT223-5N]
U6  TPS54428DDAR  [R-PDSO-G8]
U7  LTC1728ES5-3.3  Supplier Part Number 1: LTC1728ES5-3.3#TRMPBFCT-ND  [SOT23_5L_CUSTOM]
U8  TL331 Comparator  Supplier Part Number 1: 296-10168-1-ND  [SOT23_5L_CUSTOM]

### Ports
POWER_GOOD (out), PWR_EN (out), VCCIO_EN (in)

### Nets
5V: C26.1 C31.2 C34.1 C38.1 R9.1 R13.1 R14.2 U4.8(VIN) U5.2(VIN) U6.8(VIN) U8.5(VCC)
A3V3: C29.2 C37.1 J12.1 U5.3(VOUT) U7.5(VCC3)
D1V8: C32.1 C33.1 C39.2 J13.1 L5.1 R8.1 U7.4(VCC1.8)
D3V3: C24.1 C25.1 J11.1 L4.1 R6.1 R11.2
GND: C25.2 C26.2 C27.2 C28.2 C29.1 C31.1 C33.2 C34.2 C35.2 C36.2 C37.2 C38.2 C39.1 J11.2 J12.2 J13.2 R7.2 R10.2 R12.1 R15.1 SW1.2 TP1.1 TP2.1 TP3.1 TP4.1 TP5.1 TP6.1 TP7.1 TP8.1 TP9.1 TP10.1 U4.5(GND) U5.4(~{ERROR}) U5.5(GND) U6.5(GND) U7.2(GND) U8.2(GND)
POWER_GOOD: JP3.1 SW1.1 U7.1(~{RST}) ; port POWER_GOOD
PWR_EN: JP4.2 U4.1(EN) U5.1(~{SD}) U6.1(EN) ; port PWR_EN
NetC23_1: C23.1 U4.7(VBST)
NetC23_2: C23.2 L4.2 U4.6(SW)
NetC24_2: C24.2 R6.2 R7.1 U4.2(VFB)
NetC27_1: C27.1 U4.3(VREG5)
NetC28_1: C28.1 U4.4(SS)
NetC30_1: C30.1 U6.7(VBST)
NetC30_2: C30.2 L5.2 U6.6(SW)
NetC32_2: C32.2 R8.2 R10.1 U6.2(VFB)
NetC35_1: C35.1 U6.3(VREG5)
NetC36_1: C36.1 U6.4(SS)
NetJP3_2: JP3.2 R9.2
NetJP4_1: JP4.1 R13.2
NetJP4_3: JP4.3 U8.4(OUT)
NetR11_1: R11.1 R12.2 U7.3(VCCA)
NetR14_1: R14.1 R15.2 U8.1(IN-)
NetU8_3: U8.3(IN+) ; port VCCIO_EN

### Layout directives
net class PowerNet: 5V, A3V3, D1V8, D3V3

### Notes on the sheet
- D3V3 Switching Reg (3A Max.)
- J10, J12, and J11 are fallback methods for bringing in power (DNP). 7A MAX.
- A3V3 LDO
- D1V8 Switching Reg (3A Max.)
- Power Good Generator
- Jumper to pull up for testing without microzed.
  When MicroZed is installed this jumper MUST be removed, because the pull-up is on the MicroZed
- The switching regulators themselves are limited to 4A. The inductors will saturate at about 3.3A limiting the total current draw to about 3A
- 1.8V to 5V Level Shifter
- (near JP4) Jumper to pull up for testing without MicroZed
- (near TP1) Testpoint Grounds. Scatter at will.
- (near U8) Level Shifting Circuit with Threshold at .996V calculated as :
  Vth = 5V * (10.0k)/(10.0k+40.2k) = .996V
  For 1.8V CMOS signals this should be suitable
- Title
- Size:
- Date:
- Letter
- Number:
- Time:
- Revision:
- Sheet
- of
- File:

### Library data of the parts
C23 C30 = C1005X5R1A104K: Manufacturer Name: TDK; PackageReference: C1005X5R1A104K; Manufacturer Part Number: C1005X5R1A104K; Value: 100nF; Supplier 1: Digi-Key; Supplier Part Number 1: 445-1265-1-ND
C24 C32 = GRM1555C1E5R1CA01D: GRM1555C1E5R1CA0; Manufacturer Part Number: C0402C519C5GACTU; Manufacturer Name: MuRata; PackageReference: C0402C519C5GACTU; Value: 5.1pF; Supplier 1: Digi-Key; Supplier Part Number 1: 399-8972-1-ND
C25 C33 = GRM31CR60J476ME19L: GRM31CR60J476ME1; Manufacturer Name: MuRata; PackageReference: GRM31CR60J476ME19L; Manufacturer Part Number: GRM31CR60J476ME19L; Value: 47uF; Supplier 1: Digi-Key; Supplier Part Number 1: 490-3907-1-ND
C26 C34 = C3225X5R1A226M: Manufacturer Name: TDK; PackageReference: C3225X5R1A226M; Manufacturer Part Number: C3225X5R1A226M; Value: 22uF; Supplier 1: Digi-Key; Supplier Part Number 1: 445-1403-1-ND
C27 C35 = GRM155R61A105KE15D: GRM155R61A105KE1; Manufacturer Name: MuRata; PackageReference: GRM155R61A105KE15D; Manufacturer Part Number: GRM155R61A105KE15D; Value: 1uF; Supplier 1: Digi-Key; Supplier Part Number 1: 490-3890-1-ND
C28 C36 = GRM155R71E822KA01D: GRM155R71E822KA0; Manufacturer Name: MuRata; PackageReference: GRM155R71E822KA01D; Manufacturer Part Number: GRM155R71E822KA01D; Value: 8.2nF; Supplier 1: Digi-Key; Supplier Part Number 1: 490-1311-1-ND
C29 = Cap: Capacitor; Manufacturer: Samsung Electro-Mechanics America, Inc; Manufacturer Part Number: CL10A106MQ8NNNC; Published: 8-Jun-2000; LatestRevisionDate: 17-Jul-2002; LatestRevisionNote: Re-released for DXP Platform.; PackageReference: RAD-0.3; Publisher: Altium Limited; Value: 10uF; Supplier 1: Digi-Key; Supplier Part Number 1: 1276-1119-1-ND
C31 = Cap: Capacitor; Manufacturer: TDK Corporation; Manufacturer Part Number: C3216X5R0J686M160AB; Published: 8-Jun-2000; LatestRevisionDate: 17-Jul-2002; LatestRevisionNote: Re-released for DXP Platform.; PackageReference: C1206; Publisher: Altium Limited; Value: 68uF; Supplier 1: Digi-Key; Supplier Part Number 1: 445-14671-1-ND
C37 = Cap: as C5 on sheet dsau-adc; Published: 8-Jun-2000; LatestRevisionDate: 17-Jul-2002; LatestRevisionNote: Re-released for DXP Platform.; PackageReference: RAD-0.3; Publisher: Altium Limited; Supplier 1: Digi-Key; Supplier Part Number 1: 311-1343-1-ND
C38 C39 = Cap: Capacitor; Manufacturer: Yageo; Manufacturer Part Number: CC0603ZRY5V9BB104; Value: .1uF; Published: 8-Jun-2000; LatestRevisionDate: 17-Jul-2002; LatestRevisionNote: Re-released for DXP Platform.; PackageReference: RAD-0.3; Publisher: Altium Limited; Supplier 1: Digi-Key; Supplier Part Number 1: 311-1343-1-ND
J11-J13 = Header 2: as J5 on sheet dsau-motherboard-top; LatestRevisionDate: 17-Jul-2002; LatestRevisionNote: Re-released for DXP Platform.; Publisher: Altium Limited; Supplier 1: Digi-Key; Supplier Part Number 1: WM4333-ND
L4 L5 = SRN6045-2R2Y: Manufacturer Name: Bourns; PackageReference: SRN6045-2R2Y; Manufacturer Part Number: SRN6045-2R2Y; Value: 2.2uH; Supplier 1: Digi-Key; Supplier Part Number 1: SRN6045-2R2YCT-ND
R6 = CRCW040275K0FKED: Manufacturer Name: Vishay-Dale; PackageReference: CRCW040275K0FKED; Manufacturer Part Number: CRCW040275K0FKED; Value: 75k; Supplier 1: Digi-Key; Supplier Part Number 1: 541-75.0KLCT-ND
R7 R10 = CRCW040222K1FKED: Manufacturer Name: Vishay-Dale; PackageReference: CRCW040222K1FKED; Manufacturer Part Number: CRCW040222K1FKED; Value: 22.1k; Supplier 1: Digi-Key; Supplier Part Number 1: 541-22.1KLCT-ND
R8 = CRCW040275K0FKED: CRCW040230K9FKED; Manufacturer Name: Vishay-Dale; PackageReference: CRCW040230K9FKED; Manufacturer Part Number: CRCW040230K9FKED; Value: 30.9k; Supplier 1: Digi-Key; Supplier Part Number 1: 541-30.9KLCT-ND
R9 R13 = Res3: as R5 on sheet dsau-motherboard-top; Published: 8-Jun-2000; LatestRevisionDate: 29-May-2009; LatestRevisionNote: IPC-7351 Footprint Added.; PackageReference: J1-0603; Publisher: Altium Limited; PackageDescription: Chip Resistor; Supplier 1: Digi-Key; Supplier Part Number 1: 311-47KGRTR-ND
R11 = Res3: Resistor; Manufacturer: Yageo; Manufacturer Part Number: RT0603DRD0734KL; Published: 8-Jun-2000; LatestRevisionDate: 29-May-2009; LatestRevisionNote: IPC-7351 Footprint Added.; PackageReference: J1-0603; Publisher: Altium Limited; PackageDescription: Chip Resistor; Value: 34K; Supplier 1: Digi-Key; Supplier Part Number 1: 311-34KDCT-ND
R12 = Res3: Resistor; Manufacturer: Yageo; Manufacturer Part Number: RC0603JR-07100KL; Published: 8-Jun-2000; LatestRevisionDate: 29-May-2009; LatestRevisionNote: IPC-7351 Footprint Added.; PackageReference: J1-0603; Publisher: Altium Limited; PackageDescription: Chip Resistor; Value: 100K; Supplier 1: Digi-Key; Supplier Part Number 1: 311-100KGRCT-ND
R14 = Res3: Resistor; Manufacturer: Yageo; Manufacturer Part Number: RC0603FR-0740K2L; Published: 8-Jun-2000; LatestRevisionDate: 29-May-2009; LatestRevisionNote: IPC-7351 Footprint Added.; PackageReference: J1-0603; Publisher: Altium Limited; PackageDescription: Chip Resistor; Supplier 1: Digi-Key; Supplier Part Number 1: 311-40.2KHRCT-ND
R15 = Res3: Resistor; Manufacturer: Yageo; Manufacturer Part Number: RC0603FR-07220RL; Published: 8-Jun-2000; LatestRevisionDate: 29-May-2009; LatestRevisionNote: IPC-7351 Footprint Added.; PackageReference: J1-0603; Publisher: Altium Limited; PackageDescription: Chip Resistor; Supplier 1: Digi-Key; Supplier Part Number 1: 311-220HRCT-ND
SW1 = SW-PB: Switch; Manufacturer: TE Connectivity; Manufacturer Part Number: FSM4JH; Published: 24-Mar-1999; LatestRevisionDate: 17-Jul-2002; LatestRevisionNote: Re-released for DXP Platform.; PackageReference: SPST-2; Publisher: Altium Limited; Supplier 1: Digi-Key; Supplier Part Number 1: 450-1650-ND
TP1-TP10 = TESTPOINT_CW: Manufacturer: Keystone; Manufacturer Part Number: 5000; Supplier 1: Digi-Key; Supplier Part Number 1: 5000K-ND
U4 U6 = TPS54428DDAR: Imported; Frequency: 700000.0; Imax: 4.0; Vendor: Texas Instruments; Datasheet URL: http://www.ti.com/product/tps54428; Package: R-PDSO-G8; Mktg_Package: R-PDSO-G8; NSID: TPS54428DDAR; Manufacturer_Part_Number: TPS54428DDAR; Manufacturer_Name: Texas Instruments; RefDes: RefDes; Type: DEV; Value: Value; Manufacturer: Texas Instruments; Manufacturer Part Number: TPS54428DDAR; Supplier 1: Digi-key; Supplier Part Number 1: 296-30034-1-ND
U5 = LP3962: Manufacturer: Texas Instruments; Manufacturer Part Number: LP3962EMP-3.3/NOPB; Supplier 1: Digi-Key; Supplier Part Number 1: LP3962EMP-3.3/NOPBCT-ND
U7 = LTC1728ES5-3.3: Manufacturer: Linear Technology; Manufacturer Part Number: LTC1728ES5-3.3#TRMPBF; Supplier 1: Digi-Key
U8 = TL331: Manufacturer Part Number: TL331IDBVR; Manufacturer: Texas Instruments; Supplier 1: Digi-Key

## Sheet dsau-micro-zed.SchDoc: dSAU Motherboard - MicroZed
size Letter; Engineer: Christopher J. Woodall; Organization: Boston University EDF/ECE; DocumentNumber: 7; Revision: A; SheetNumber: 7; SheetTotal: 10; EMAIL: cwoodall@bu.edu; TeamName: Team 19; ProjectName: dSAU
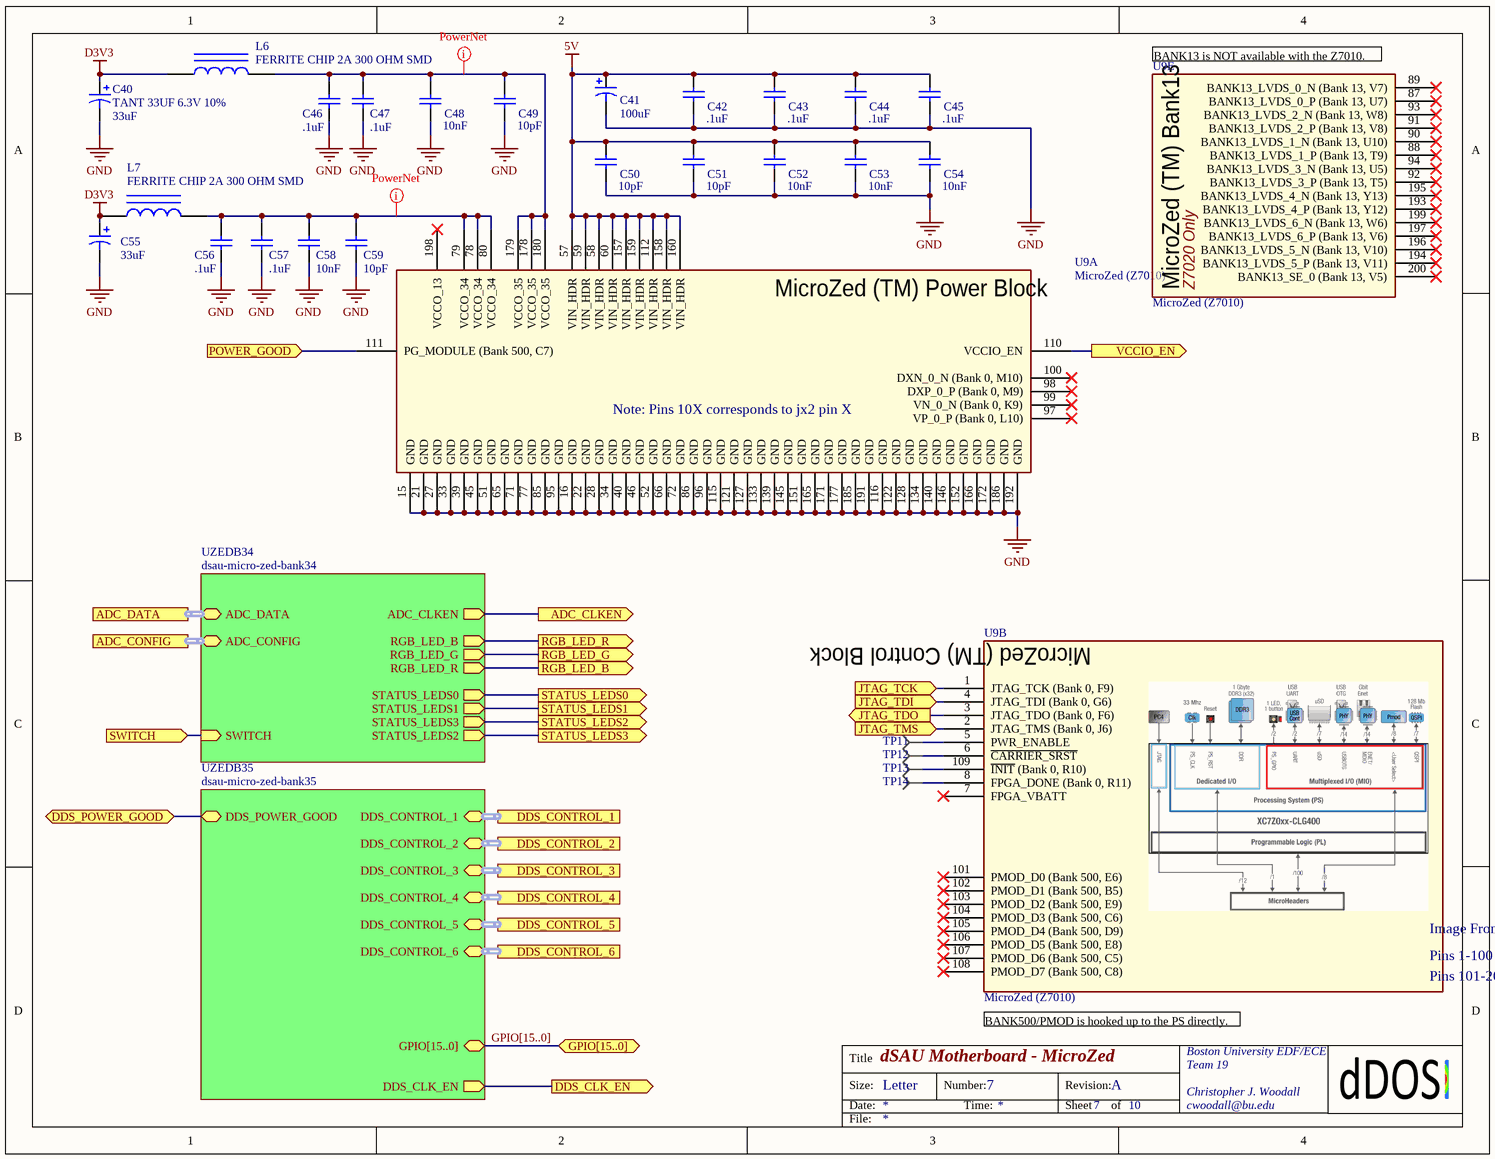
[diagram p4: dsau-micro-zed.SchDoc]

### Parts
C40  TANT 33UF 6.3V 10%  value 33uF  [CAPC2012L]
C41  value 100uF  [CAPPOL3216]  (hidden comment: TANT 100UF 10V 20%)
C42  value .1uF  [CAPC1608L]  (hidden comment: CER 0.1UF 50V Y5V)
C43  value .1uF  [CAPC1608L]  (hidden comment: CER 0.1UF 50V Y5V)
C44  value .1uF  [CAPC1608L]  (hidden comment: CER 0.1UF 50V Y5V)
C45  value .1uF  [CAPC1608L]  (hidden comment: CER 0.1UF 50V Y5V)
C46  value .1uF  [CAPC1608L]  (hidden comment: CER 0.1UF 50V Y5V)
C47  value .1uF  [CAPC1608L]  (hidden comment: CER 0.1UF 50V Y5V)
C48  value 10nF  [CAPC1608L]  (hidden comment: CER 10NF 25V 10% NP0)
C49  value 10pF  [CAPC1608L]  (hidden comment: CER 10PF 50V 5% NP0)
C50  value 10pF  [CAPC1608L]  (hidden comment: CER 10PF 50V 5% NP0)
C51  value 10pF  [CAPC1608L]  (hidden comment: CER 10PF 50V 5% NP0)
C52  value 10nF  [CAPC1608L]  (hidden comment: CER 10NF 25V 10% NP0)
C53  value 10nF  [CAPC1608L]  (hidden comment: CER 10NF 25V 10% NP0)
C54  value 10nF  [CAPC1608L]  (hidden comment: CER 10NF 25V 10% NP0)
C55  value 33uF  [CAPC2012L]  (hidden comment: TANT 33UF 6.3V 10%)
C56  value .1uF  [CAPC1608L]  (hidden comment: CER 0.1UF 50V Y5V)
C57  value .1uF  [CAPC1608L]  (hidden comment: CER 0.1UF 50V Y5V)
C58  value 10nF  [CAPC1608L]  (hidden comment: CER 10NF 25V 10% NP0)
C59  value 10pF  [CAPC1608L]  (hidden comment: CER 10PF 50V 5% NP0)
L6  FERRITE CHIP 2A 300 OHM SMD  [INDC1608L]
L7  FERRITE CHIP 2A 300 OHM SMD  [INDC1608L]
TP11  TESTPOINT_CW  [PIN1]  (value not drawn)
TP12  TESTPOINT_CW  [PIN1]  (value not drawn)
TP13  TESTPOINT_CW  [PIN1]  (value not drawn)
TP14  TESTPOINT_CW  [PIN1]  (value not drawn)
U9  MicroZed (Z7010)  [MicroZed_MatingSide]  (parts A,B,E of 5)

### Sub-sheets
UZEDB34 = dsau-micro-zed-bank34: ADC_DATA (harness ADS62P49_LVDSDDR), ADC_CONFIG (harness ADS62P49_SPI_CONFIG), ADC_CLKEN (out), RGB_LED_B (out), RGB_LED_G (out), RGB_LED_R (out), SWITCH (in), STATUS_LEDS0 (out), STATUS_LEDS1 (out), STATUS_LEDS3 (out), STATUS_LEDS2 (out)
UZEDB35 = dsau-micro-zed-bank35: DDS_CONTROL_1 (harness DDS_CONNECTOR), DDS_CONTROL_2 (harness DDS_CONNECTOR), DDS_CONTROL_3 (harness DDS_CONNECTOR), DDS_CONTROL_4 (harness DDS_CONNECTOR), DDS_CONTROL_5 (harness DDS_CONNECTOR), DDS_CONTROL_6 (harness DDS_CONNECTOR), DDS_CLK_EN (out), GPIO[15..0] (bidir), DDS_POWER_GOOD

### Ports
ADC_CLKEN (out), ADC_CONFIG (harness ADS62P49_SPI_CONFIG), ADC_DATA (harness ADS62P49_LVDSDDR), DDS_CLK_EN (out), DDS_CONTROL_1 (harness DDS_CONNECTOR), DDS_CONTROL_2 (harness DDS_CONNECTOR), DDS_CONTROL_3 (harness DDS_CONNECTOR), DDS_CONTROL_4 (harness DDS_CONNECTOR), DDS_CONTROL_5 (harness DDS_CONNECTOR), DDS_CONTROL_6 (harness DDS_CONNECTOR), DDS_POWER_GOOD, GPIO[15..0] (bidir), JTAG_TCK (in), JTAG_TDI (in), JTAG_TDO (out), JTAG_TMS (in), POWER_GOOD (in), RGB_LED_B (out), RGB_LED_G (out), RGB_LED_R (out), STATUS_LEDS0 (out), STATUS_LEDS1 (out), STATUS_LEDS2 (out), STATUS_LEDS3 (out), SWITCH (in), VCCIO_EN (out)

### Nets
5V: C41.1 C42.1 C43.1 C44.1 C45.1 C50.1 C51.1 C52.1 C53.1 C54.1 U9.57(VIN_HDR) U9.58(VIN_HDR) U9.59(VIN_HDR) U9.60(VIN_HDR) U9.112(VIN_HDR) U9.157(VIN_HDR) U9.158(VIN_HDR) U9.159(VIN_HDR) U9.160(VIN_HDR)
D3V3: C40.1 C55.1 L6.1 L7.1
GND: C40.2 C41.2 C42.2 C43.2 C44.2 C45.2 C46.2 C47.2 C48.2 C49.2 C50.2 C51.2 C52.2 C53.2 C54.2 C55.2 C56.2 C57.2 C58.2 C59.2 U9.15(GND) U9.16(GND) U9.21(GND) U9.22(GND) U9.27(GND) U9.28(GND) U9.33(GND) U9.34(GND) U9.39(GND) U9.40(GND) U9.45(GND) U9.46(GND) U9.51(GND) U9.52(GND) U9.65(GND) U9.66(GND) U9.71(GND) U9.72(GND) U9.77(GND) U9.85(GND) U9.86(GND) U9.95(GND) U9.96(GND) U9.115(GND) U9.116(GND) U9.121(GND) U9.122(GND) U9.127(GND) U9.128(GND) U9.133(GND) U9.134(GND) U9.139(GND) U9.140(GND) U9.145(GND) U9.146(GND) U9.151(GND) U9.152(GND) U9.165(GND) U9.166(GND) U9.171(GND) U9.172(GND) U9.177(GND) U9.185(GND) U9.186(GND) U9.191(GND) U9.192(GND)
POWER_GOOD: U9.111(PG_MODULE_(Bank_500,_C7)) ; port POWER_GOOD
TCK: U9.1(JTAG_TCK_(Bank_0,_F9)) ; port JTAG_TCK
TDI: U9.4(JTAG_TDI_(Bank_0,_G6)) ; port JTAG_TDI
TDO: U9.3(JTAG_TDO_(Bank_0,_F6)) ; port JTAG_TDO
TMS: U9.2(JTAG_TMS_(Bank_0,_J6)) ; port JTAG_TMS
NetC46_1: C46.1 C47.1 C48.1 C49.1 L6.2 U9.178(VCCO_35) U9.179(VCCO_35) U9.180(VCCO_35)
NetC56_1: C56.1 C57.1 C58.1 C59.1 L7.2 U9.78(VCCO_34) U9.79(VCCO_34) U9.80(VCCO_34)
NetJ1_1_8: port DDS_POWER_GOOD, sheet UZEDB35/DDS_POWER_GOOD
NetJP1_3: port ADC_CLKEN, sheet UZEDB34/ADC_CLKEN
NetJP5_3: port DDS_CLK_EN, sheet UZEDB35/DDS_CLK_EN
NetQ3_1: port RGB_LED_R, sheet UZEDB34/RGB_LED_B
NetQ4_1: port RGB_LED_G, sheet UZEDB34/RGB_LED_G
NetQ5_1: port RGB_LED_B, sheet UZEDB34/RGB_LED_R
NetQ6_1: port STATUS_LEDS0, sheet UZEDB34/STATUS_LEDS0
NetQ7_1: port STATUS_LEDS1, sheet UZEDB34/STATUS_LEDS1
NetQ8_1: port STATUS_LEDS2, sheet UZEDB34/STATUS_LEDS3
NetQ9_1: port STATUS_LEDS3, sheet UZEDB34/STATUS_LEDS2
NetR18_2: port SWITCH, sheet UZEDB34/SWITCH
NetTP11_1: TP11.1 U9.5(PWR_ENABLE)
NetTP12_1: TP12.1 U9.6(~{CARRIER_SRST})
NetTP13_1: TP13.1 U9.109(~{INIT}_(Bank_0,_R10))
NetTP14_1: TP14.1 U9.8(FPGA_DONE_(Bank_0,_R11))
NetU8_3: U9.110(VCCIO_EN) ; port VCCIO_EN

Not connected (* = marked no-connect by the designer): U9 7(FPGA_VBATT)* 87(BANK13_LVDS_0_P_(Bank_13,_U7))* 88(BANK13_LVDS_1_P_(Bank_13,_T9))* 89(BANK13_LVDS_0_N_(Bank_13,_V7))* 90(BANK13_LVDS_1_N_(Bank_13,_U10))* 91(BANK13_LVDS_2_P_(Bank_13,_V8))* 92(BANK13_LVDS_3_P_(Bank_13,_T5))* 93(BANK13_LVDS_2_N_(Bank_13,_W8))* 94(BANK13_LVDS_3_N_(Bank_13,_U5))* 97(VP_0_P_(Bank_0,_L10))* 98(DXP_0_P_(Bank_0,_M9))* 99(VN_0_N_(Bank_0,_K9))* 100(DXN_0_N_(Bank_0,_M10))* 101(PMOD_D0_(Bank_500,_E6))* 102(PMOD_D1_(Bank_500,_B5))* 103(PMOD_D2_(Bank_500,_E9))* 104(PMOD_D3_(Bank_500,_C6))* 105(PMOD_D4_(Bank_500,_D9))* 106(PMOD_D5_(Bank_500,_E8))* 107(PMOD_D6_(Bank_500,_C5))* 108(PMOD_D7_(Bank_500,_C8))* 193(BANK13_LVDS_4_P_(Bank_13,_Y12))* 194(BANK13_LVDS_5_P_(Bank_13,_V11))* 195(BANK13_LVDS_4_N_(Bank_13,_Y13))* 196(BANK13_LVDS_5_N_(Bank_13,_V10))* 197(BANK13_LVDS_6_P_(Bank_13,_V6))* 198(VCCO_13)* 199(BANK13_LVDS_6_N_(Bank_13,_W6))* 200(BANK13_SE_0_(Bank_13,_V5))*

### Buses and harness runs
bus GPIO[15..0] = port GPIO[15..0] = sheet UZEDB35/GPIO[15..0]
harness port ADC_CONFIG = sheet UZEDB34/ADC_CONFIG
harness port ADC_DATA = sheet UZEDB34/ADC_DATA
harness port DDS_CONTROL_1 = sheet UZEDB35/DDS_CONTROL_1
harness port DDS_CONTROL_2 = sheet UZEDB35/DDS_CONTROL_2
harness port DDS_CONTROL_3 = sheet UZEDB35/DDS_CONTROL_3
harness port DDS_CONTROL_4 = sheet UZEDB35/DDS_CONTROL_4
harness port DDS_CONTROL_5 = sheet UZEDB35/DDS_CONTROL_5
harness port DDS_CONTROL_6 = sheet UZEDB35/DDS_CONTROL_6

### Layout directives
net class PowerNet: NetC46_1, NetC56_1

### Notes on the sheet
- (near U9) BANK13 is NOT available with the Z7010.
- (near U9) BANK500/PMOD is hooked up to the PS directly.
- Title
- Size:
- Date:
- Letter
- Number:
- Time:
- Revision:
- Sheet
- of
- File:
- (in symbol MicroZed, part A) MicroZed (TM) Power Block; Note: Pins 10X corresponds to jx2 pin X
- (in symbol MicroZed, part B) MicroZed (TM) Control Block; Image From zedboard.org; Pins 1-100 correspond to JX1 1-100; Pins 101-200 correspond to JX2 1-100
- (in symbol MicroZed, part E) MicroZed (TM) Bank13; Z7020 Only

### Library data of the parts
C40 C55 = Cap Pol3: as C4 on sheet dsau-adc; Published: 8-Jun-2000; LatestRevisionDate: 29-May-2009; LatestRevisionNote: IPC-7351 Footprint Added.; PackageReference: C1206; Publisher: Altium Limited; PackageDescription: Chip Capacitor; Supplier 1: Digi-Key; Supplier Part Number 1: 478-1755-1-ND
C41 = Cap Pol3: as C22 on sheet dsau-motherboard-top; Published: 8-Jun-2000; LatestRevisionDate: 29-May-2009; LatestRevisionNote: IPC-7351 Footprint Added.; PackageReference: C1206; Publisher: Altium Limited; PackageDescription: Chip Capacitor; Supplier 1: Digi-Key; Supplier Part Number 1: 718-1921-1-ND
C42-C47 C56 C57 = Cap: as C5 on sheet dsau-adc; Published: 8-Jun-2000; LatestRevisionDate: 17-Jul-2002; LatestRevisionNote: Re-released for DXP Platform.; PackageReference: RAD-0.3; Publisher: Altium Limited; Supplier 1: Digi-Key; Supplier Part Number 1: 311-1343-1-ND
C48 C52-C54 C58 = Cap: as C9 on sheet dsau-adc; Published: 8-Jun-2000; LatestRevisionDate: 17-Jul-2002; LatestRevisionNote: Re-released for DXP Platform.; PackageReference: RAD-0.3; Publisher: Altium Limited; Supplier 1: Digi-Key; Supplier Part Number 1: 399-8987-1-ND
C49-C51 C59 = Cap: as C10 on sheet dsau-adc; Published: 8-Jun-2000; LatestRevisionDate: 17-Jul-2002; LatestRevisionNote: Re-released for DXP Platform.; PackageReference: RAD-0.3; Publisher: Altium Limited; Supplier 1: Digi-Key; Supplier Part Number 1: 1276-2154-1-ND
L6 L7 = Inductor Iron: as L1 on sheet dsau-adc; Published: 24-Mar-1999; LatestRevisionDate: 17-Jul-2002; LatestRevisionNote: Re-released for DXP Platform.; PackageReference: AXIAL-0.9; Publisher: Altium Limited; Supplier 1: Digi-Key; Supplier Part Number 1: 240-2374-1-ND
TP11-TP14 = TESTPOINT_CW: as TP1 on sheet dsau-power; Supplier 1: Digi-Key; Supplier Part Number 1: 5000K-ND
U9 = MicroZed: MicroZed is a low-cost development board based on the Xilinx Zynq-7000 All Programmable SoC. Its unique design allows it to be used as both a stand-alone evaluation board for basic SoC experimentation, or combined with a carrier card as an embeddable syst; Manufacturer: Avnet; Manfacturer Part Number: AES-Z7MB-7Z010-G; Supplier 1: Avnet; Supplier Part Number 1: AES-Z7MB-7Z010-G; Supplier 2: Mouser; Supplier Part Number 2: 649-61083-101400LF

## Sheet dsau-micro-zed-bank34.SchDoc: dSAU Motherboard - uZed BANK34
size Letter; Engineer: Christopher J. Woodall; Organization: Boston University EDF/ECE; DocumentNumber: 8; Revision: A; SheetNumber: 8; SheetTotal: 10; EMAIL: cwoodall@bu.edu; TeamName: Team 19; ProjectName: dSAU
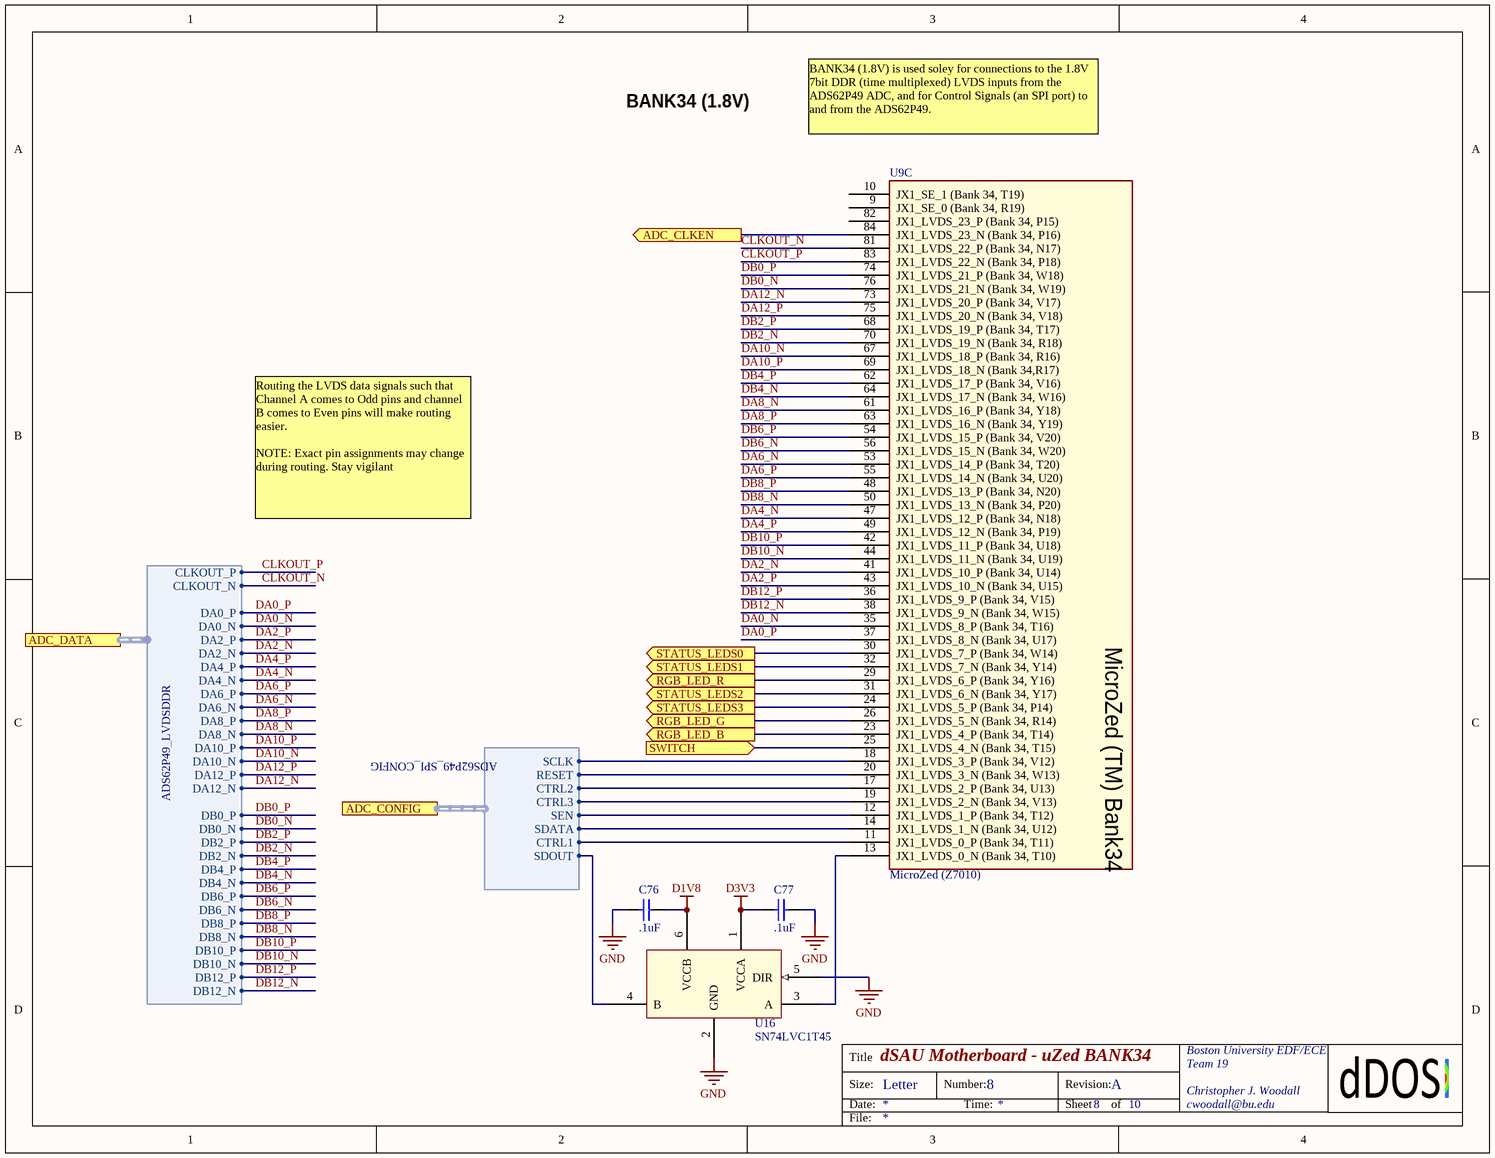
[diagram p5: dsau-micro-zed-bank34.SchDoc]

### Parts
C76  value .1uF  [CAPC1608L]  (hidden comment: CER 0.1UF 50V Y5V)
C77  value .1uF  [CAPC1608L]  (hidden comment: CER 0.1UF 50V Y5V)
U9  MicroZed (Z7010)  [MicroZed_MatingSide]  (part C of 5)
U16  SN74LVC1T45  [SOT23_6_CUSTOM]

### Ports
ADC_CLKEN (out), ADC_CONFIG (harness ADS62P49_SPI_CONFIG), ADC_DATA (harness ADS62P49_LVDSDDR), RGB_LED_B (out), RGB_LED_G (out), RGB_LED_R (out), STATUS_LEDS0 (out), STATUS_LEDS1 (out), STATUS_LEDS2 (out), STATUS_LEDS3 (out), SWITCH (in)

### Harnesses
ADS62P49_LVDSDDR: DA0_N, DA2_N, DA4_N, DA6_N, DA8_N, DA10_N, DA12_N, DA0_P, DA2_P, DA4_P, DA6_P, DA8_P, DA10_P, DA12_P, DB0_N, DB2_N, DB4_N, DB6_N, DB8_N, DB10_N, DB12_N, DB0_P, DB2_P, DB4_P, DB6_P, DB8_P, DB10_P, DB12_P, CLKOUT_P, CLKOUT_N
ADS62P49_SPI_CONFIG: CTRL1, CTRL2, CTRL3, RESET, SCLK, SDATA, SDOUT, SEN

### Nets
D1V8: C76.2 U16.6(VCCB)
D3V3: C77.1 U16.1(VCCA)
GND: C76.1 C77.2 U16.2(GND) U16.5(DIR)
CLKOUT_N: U9.81(JX1_LVDS_22_P_(Bank_34,_N17)) ; port ADC_DATA.CLKOUT_N
CLKOUT_P: U9.83(JX1_LVDS_22_N_(Bank_34,_P18)) ; port ADC_DATA.CLKOUT_P
DA0_N: U9.35(JX1_LVDS_8_P_(Bank_34,_T16)) ; port ADC_DATA.DA0_N
DA0_P: U9.37(JX1_LVDS_8_N_(Bank_34,_U17)) ; port ADC_DATA.DA0_P
DA2_N: U9.41(JX1_LVDS_10_P_(Bank_34,_U14)) ; port ADC_DATA.DA2_N
DA2_P: U9.43(JX1_LVDS_10_N_(Bank_34,_U15)) ; port ADC_DATA.DA2_P
DA4_N: U9.47(JX1_LVDS_12_P_(Bank_34,_N18)) ; port ADC_DATA.DA4_N
DA4_P: U9.49(JX1_LVDS_12_N_(Bank_34,_P19)) ; port ADC_DATA.DA4_P
DA6_N: U9.53(JX1_LVDS_14_P_(Bank_34,_T20)) ; port ADC_DATA.DA6_N
DA6_P: U9.55(JX1_LVDS_14_N_(Bank_34,_U20)) ; port ADC_DATA.DA6_P
DA8_N: U9.61(JX1_LVDS_16_P_(Bank_34,_Y18)) ; port ADC_DATA.DA8_N
DA8_P: U9.63(JX1_LVDS_16_N_(Bank_34,_Y19)) ; port ADC_DATA.DA8_P
DA10_N: U9.67(JX1_LVDS_18_P_(Bank_34,_R16)) ; port ADC_DATA.DA10_N
DA10_P: U9.69(JX1_LVDS_18_N_(Bank_34,R17)) ; port ADC_DATA.DA10_P
DA12_N: U9.73(JX1_LVDS_20_P_(Bank_34,_V17)) ; port ADC_DATA.DA12_N
DA12_P: U9.75(JX1_LVDS_20_N_(Bank_34,_V18)) ; port ADC_DATA.DA12_P
DB0_N: U9.76(JX1_LVDS_21_N_(Bank_34,_W19)) ; port ADC_DATA.DB0_N
DB0_P: U9.74(JX1_LVDS_21_P_(Bank_34,_W18)) ; port ADC_DATA.DB0_P
DB2_N: U9.70(JX1_LVDS_19_N_(Bank_34,_R18)) ; port ADC_DATA.DB2_N
DB2_P: U9.68(JX1_LVDS_19_P_(Bank_34,_T17)) ; port ADC_DATA.DB2_P
DB4_N: U9.64(JX1_LVDS_17_N_(Bank_34,_W16)) ; port ADC_DATA.DB4_N
DB4_P: U9.62(JX1_LVDS_17_P_(Bank_34,_V16)) ; port ADC_DATA.DB4_P
DB6_N: U9.56(JX1_LVDS_15_N_(Bank_34,_W20)) ; port ADC_DATA.DB6_N
DB6_P: U9.54(JX1_LVDS_15_P_(Bank_34,_V20)) ; port ADC_DATA.DB6_P
DB8_N: U9.50(JX1_LVDS_13_N_(Bank_34,_P20)) ; port ADC_DATA.DB8_N
DB8_P: U9.48(JX1_LVDS_13_P_(Bank_34,_N20)) ; port ADC_DATA.DB8_P
DB10_N: U9.44(JX1_LVDS_11_N_(Bank_34,_U19)) ; port ADC_DATA.DB10_N
DB10_P: U9.42(JX1_LVDS_11_P_(Bank_34,_U18)) ; port ADC_DATA.DB10_P
DB12_N: U9.38(JX1_LVDS_9_N_(Bank_34,_W15)) ; port ADC_DATA.DB12_N
DB12_P: U9.36(JX1_LVDS_9_P_(Bank_34,_V15)) ; port ADC_DATA.DB12_P
NetJP1_3: U9.84(JX1_LVDS_23_N_(Bank_34,_P16)) ; port ADC_CLKEN
NetQ3_1: U9.23(JX1_LVDS_4_P_(Bank_34,_T14)) ; port RGB_LED_B
NetQ4_1: U9.26(JX1_LVDS_5_N_(Bank_34,_R14)) ; port RGB_LED_G
NetQ5_1: U9.29(JX1_LVDS_6_P_(Bank_34,_Y16)) ; port RGB_LED_R
NetQ6_1: U9.30(JX1_LVDS_7_P_(Bank_34,_W14)) ; port STATUS_LEDS0
NetQ7_1: U9.32(JX1_LVDS_7_N_(Bank_34,_Y14)) ; port STATUS_LEDS1
NetQ8_1: U9.24(JX1_LVDS_5_P_(Bank_34,_P14)) ; port STATUS_LEDS3
NetQ9_1: U9.31(JX1_LVDS_6_N_(Bank_34,_Y17)) ; port STATUS_LEDS2
NetR18_2: U9.25(JX1_LVDS_4_N_(Bank_34,_T15)) ; port SWITCH
NetU2_12: U9.20(JX1_LVDS_3_N_(Bank_34,_W13)) ; port ADC_CONFIG.RESET
NetU2_13: U9.18(JX1_LVDS_3_P_(Bank_34,_V12)) ; port ADC_CONFIG.SCLK
NetU2_14: U9.14(JX1_LVDS_1_N_(Bank_34,_U12)) ; port ADC_CONFIG.SDATA
NetU2_15: U9.12(JX1_LVDS_1_P_(Bank_34,_T12)) ; port ADC_CONFIG.SEN
NetU2_35: U9.11(JX1_LVDS_0_P_(Bank_34,_T11)) ; port ADC_CONFIG.CTRL1
NetU2_36: U9.17(JX1_LVDS_2_P_(Bank_34,_U13)) ; port ADC_CONFIG.CTRL2
NetU2_37: U9.19(JX1_LVDS_2_N_(Bank_34,_V13)) ; port ADC_CONFIG.CTRL3
NetU2_64: U16.4(B) ; port ADC_CONFIG.SDOUT
NetU9_13: U9.13(JX1_LVDS_0_N_(Bank_34,_T10)) U16.3(A)

Not connected (* = marked no-connect by the designer): U9 9(JX1_SE_0_(Bank_34,_R19)) 10(JX1_SE_1_(Bank_34,_T19)) 82(JX1_LVDS_23_P_(Bank_34,_P15))

### Notes on the sheet
- BANK34 (1.8V)
- BANK34 (1.8V) is used soley for connections to the 1.8V 7bit DDR (time multiplexed) LVDS inputs from the ADS62P49 ADC, and for Control Signals (an SPI port) to and from the ADS62P49.
- Routing the LVDS data signals such that Channel A comes to Odd pins and channel B comes to Even pins will make routing easier.
  NOTE: Exact pin assignments may change during routing. Stay vigilant
- Title
- Size:
- Date:
- Letter
- Number:
- Time:
- Revision:
- Sheet
- of
- File:
- (in symbol MicroZed, part C) MicroZed (TM) Bank34

### Library data of the parts
C76 C77 = Cap: as C5 on sheet dsau-adc; Published: 8-Jun-2000; LatestRevisionDate: 17-Jul-2002; LatestRevisionNote: Re-released for DXP Platform.; PackageReference: RAD-0.3; Publisher: Altium Limited; Supplier 1: Digi-Key; Supplier Part Number 1: 311-1343-1-ND
U9 = MicroZed: as U9 on sheet dsau-micro-zed; Supplier 1: Avnet; Supplier Part Number 1: AES-Z7MB-7Z010-G; Supplier 2: Mouser; Supplier Part Number 2: 649-61083-101400LF
U16 = SN74LVC1T45: This single-bit noninverting bus transceiver uses two separate configurable power-supply rails. The A port is  designed to track VCCA. VCCA accepts any supply voltage from 1.65 V to 5.5 V. The B port is designed to track  VCCB. VCCB accepts any supply vol; Manufacturer: Texas Instruments; Value: SN74LVC1T45; Manufacturer Part Number: SN74LVC1T45; Supplier 1: Digikey; Supplier Part Number 1: 296-16843-1-ND